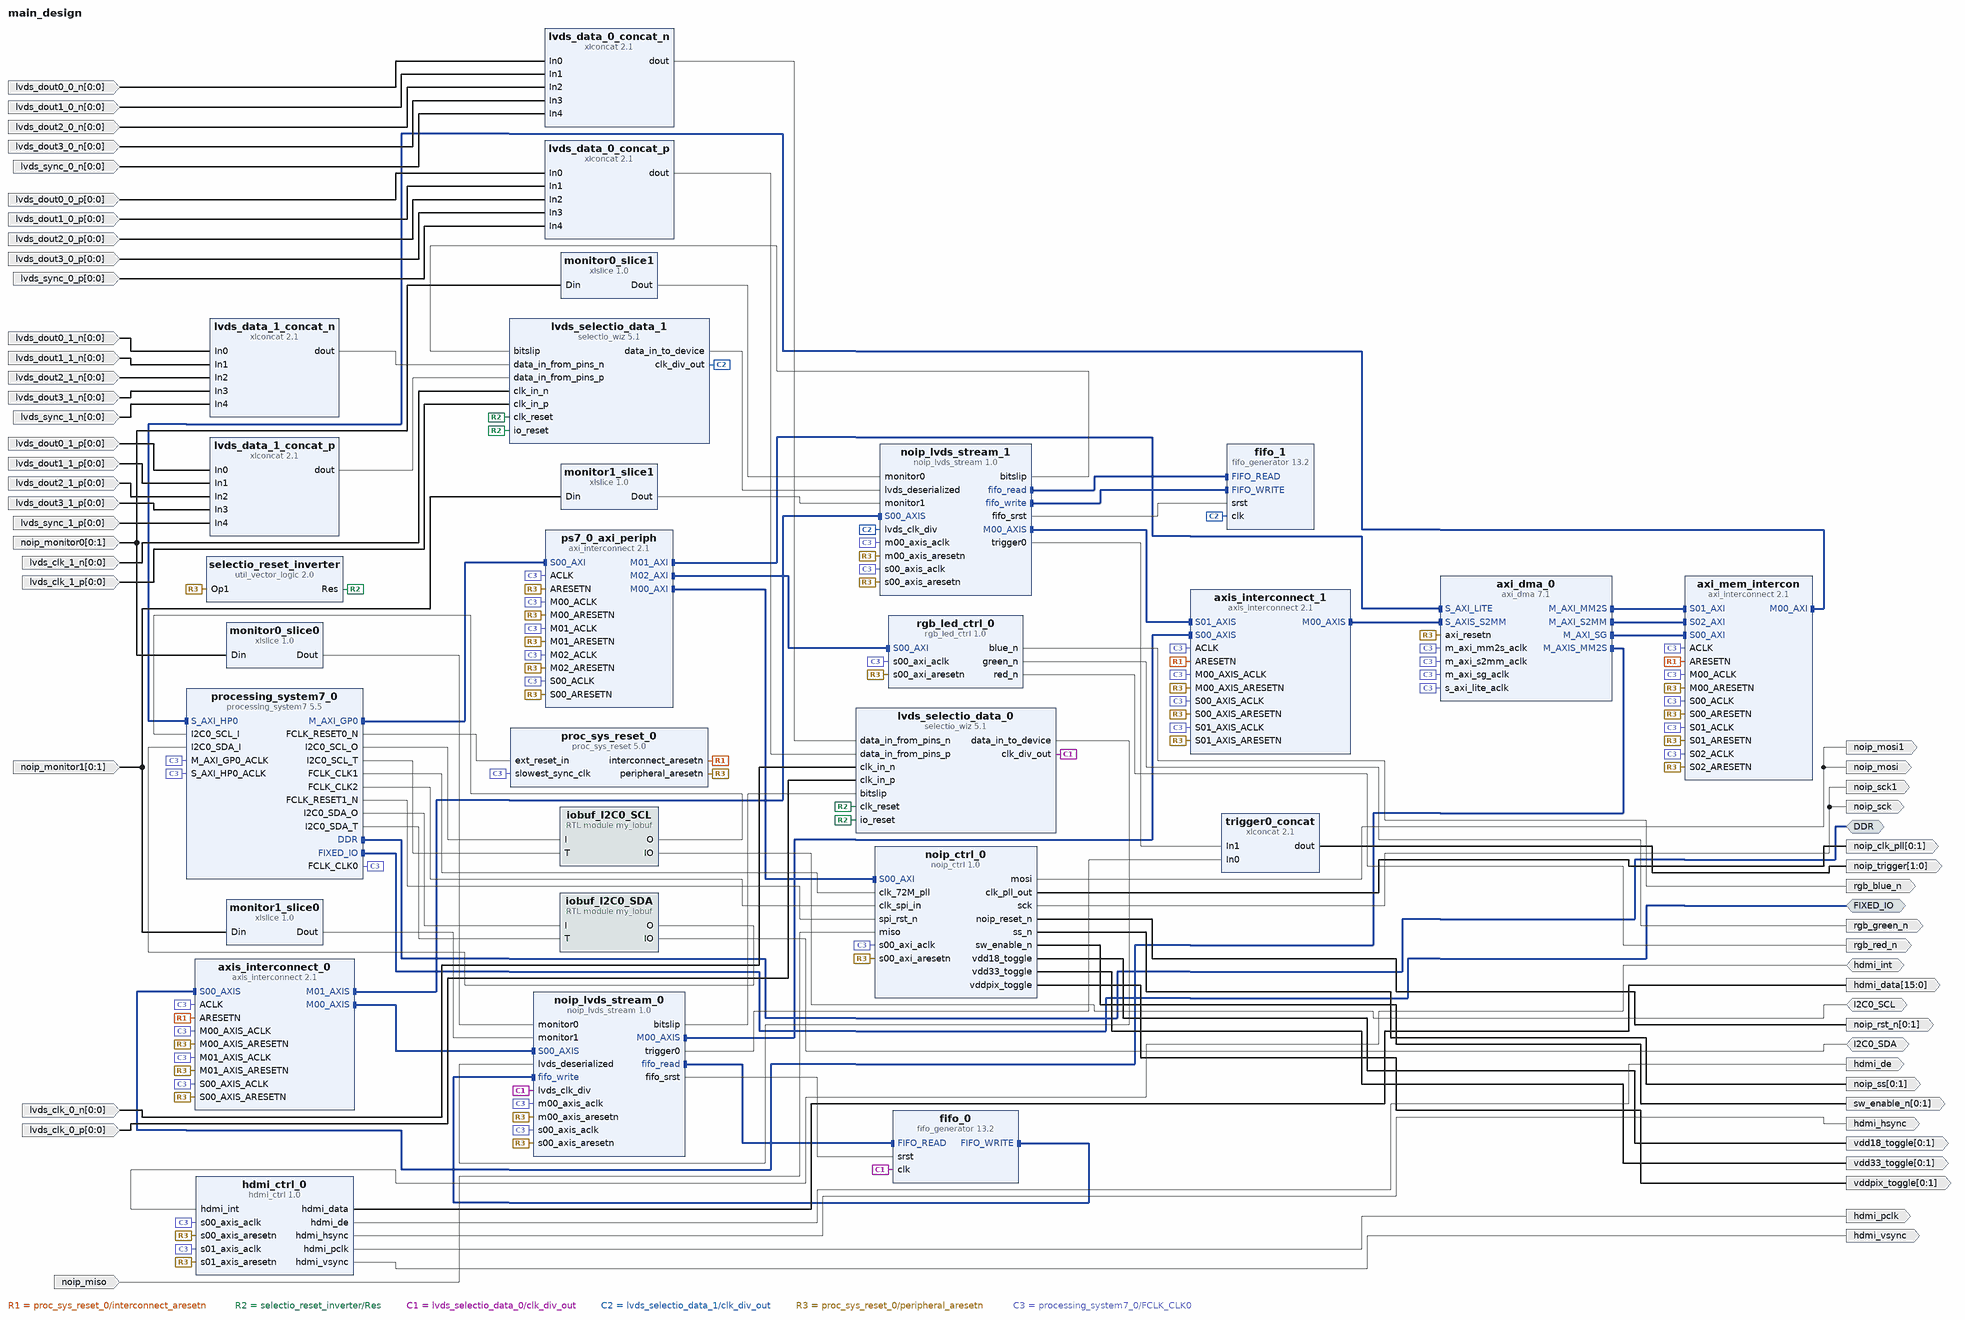
[diagram p0: block diagram of the top level]
# Vivado block design main_design, xc7z020clg400-2, Vivado 2024.1
create_bd_design main_design

create_bd_intf_port -mode Master -vlnv xilinx.com:interface:ddrx_rtl:1.0 DDR
create_bd_intf_port -mode Master -vlnv xilinx.com:display_processing_system7:fixedio_rtl:1.0 FIXED_IO
create_bd_port -dir O noip_mosi
create_bd_port -dir I noip_miso
create_bd_port -dir O noip_sck
create_bd_port -dir I -from 0 -to 0 -type clk lvds_clk_0_p
set_property -dict {CONFIG.FREQ_HZ 360000000} [get_bd_ports lvds_clk_0_p]
create_bd_port -dir I -from 0 -to 0 -type clk lvds_clk_0_n
set_property -dict {CONFIG.FREQ_HZ 360000000} [get_bd_ports lvds_clk_0_n]
create_bd_port -dir O -from 0 -to 1 noip_ss
create_bd_port -dir O -from 0 -to 1 noip_clk_pll
create_bd_port -dir O -from 1 -to 0 noip_trigger
create_bd_port -dir I -from 0 -to 1 -type data noip_monitor0
create_bd_port -dir I -from 0 -to 1 -type data noip_monitor1
create_bd_port -dir O -from 0 -to 1 noip_rst_n
create_bd_port -dir O -from 0 -to 1 vdd18_toggle
create_bd_port -dir O -from 0 -to 1 vdd33_toggle
create_bd_port -dir O -from 0 -to 1 vddpix_toggle
create_bd_port -dir O -from 0 -to 1 sw_enable_n
create_bd_port -dir I -from 0 -to 0 -type clk lvds_sync_0_p
create_bd_port -dir I -from 0 -to 0 -type clk lvds_sync_0_n
create_bd_port -dir I -from 0 -to 0 -type clk lvds_dout0_0_p
create_bd_port -dir I -from 0 -to 0 -type clk lvds_dout0_0_n
create_bd_port -dir I -from 0 -to 0 -type clk lvds_dout1_0_n
create_bd_port -dir I -from 0 -to 0 -type clk lvds_dout1_0_p
create_bd_port -dir I -from 0 -to 0 -type clk lvds_dout2_0_n
create_bd_port -dir I -from 0 -to 0 -type clk lvds_dout2_0_p
create_bd_port -dir I -from 0 -to 0 -type clk lvds_dout3_0_n
create_bd_port -dir I -from 0 -to 0 -type clk lvds_dout3_0_p
create_bd_port -dir I -from 0 -to 0 -type clk lvds_clk_1_n
set_property -dict {CONFIG.FREQ_HZ 360000000} [get_bd_ports lvds_clk_1_n]
create_bd_port -dir I -from 0 -to 0 -type clk lvds_clk_1_p
set_property -dict {CONFIG.FREQ_HZ 360000000} [get_bd_ports lvds_clk_1_p]
create_bd_port -dir I -from 0 -to 0 -type clk lvds_dout0_1_n
create_bd_port -dir I -from 0 -to 0 -type clk lvds_dout0_1_p
create_bd_port -dir I -from 0 -to 0 -type clk lvds_dout1_1_n
create_bd_port -dir I -from 0 -to 0 -type clk lvds_dout1_1_p
create_bd_port -dir I -from 0 -to 0 -type clk lvds_dout2_1_n
create_bd_port -dir I -from 0 -to 0 -type clk lvds_dout2_1_p
create_bd_port -dir I -from 0 -to 0 -type clk lvds_dout3_1_n
create_bd_port -dir I -from 0 -to 0 -type clk lvds_dout3_1_p
create_bd_port -dir I -from 0 -to 0 -type clk lvds_sync_1_p
create_bd_port -dir I -from 0 -to 0 -type clk lvds_sync_1_n
create_bd_port -dir O noip_mosi1
create_bd_port -dir O noip_sck1
create_bd_port -dir O -from 15 -to 0 hdmi_data
create_bd_port -dir O hdmi_vsync
create_bd_port -dir O hdmi_hsync
create_bd_port -dir O hdmi_de
create_bd_port -dir O -type clk hdmi_pclk
create_bd_port -dir IO hdmi_int
create_bd_port -dir IO I2C0_SDA
create_bd_port -dir IO I2C0_SCL
create_bd_port -dir O rgb_green_n
create_bd_port -dir O rgb_red_n
create_bd_port -dir O rgb_blue_n

create_bd_cell -type ip -vlnv xilinx.com:ip:processing_system7:5.5 processing_system7_0
set_property -dict [list \
  CONFIG.PCW_ENET0_ENET0_IO {MIO 16 .. 27} \
  CONFIG.PCW_ENET0_GRP_MDIO_ENABLE 0 \
  CONFIG.PCW_ENET0_PERIPHERAL_ENABLE 1 \
  CONFIG.PCW_EN_CLK1_PORT 1 \
  CONFIG.PCW_EN_CLK2_PORT 1 \
  CONFIG.PCW_EN_RST1_PORT 1 \
  CONFIG.PCW_FCLK_CLK1_BUF TRUE \
  CONFIG.PCW_FCLK_CLK2_BUF TRUE \
  CONFIG.PCW_FPGA0_PERIPHERAL_FREQMHZ 180 \
  CONFIG.PCW_FPGA1_PERIPHERAL_FREQMHZ 72 \
  CONFIG.PCW_FPGA2_PERIPHERAL_FREQMHZ 12 \
  CONFIG.PCW_FPGA_FCLK1_ENABLE 1 \
  CONFIG.PCW_FPGA_FCLK2_ENABLE 1 \
  CONFIG.PCW_GPIO_MIO_GPIO_ENABLE 0 \
  CONFIG.PCW_I2C0_I2C0_IO EMIO \
  CONFIG.PCW_I2C0_PERIPHERAL_ENABLE 1 \
  CONFIG.PCW_I2C_PERIPHERAL_FREQMHZ 111.111115 \
  CONFIG.PCW_UART1_PERIPHERAL_ENABLE 1 \
  CONFIG.PCW_UART1_UART1_IO {MIO 48 .. 49} \
  CONFIG.PCW_UART_PERIPHERAL_FREQMHZ 100 \
  CONFIG.PCW_UIPARAM_GENERATE_SUMMARY NONE \
  CONFIG.PCW_USE_S_AXI_HP0 1 \
] [get_bd_cells processing_system7_0]
# 96 more settings of processing_system7_0 are not shown: defaults, MIO pin electricals, DDR timing, and values the tool derives
create_bd_cell -type ip -vlnv xilinx.com:ip:proc_sys_reset:5.0 proc_sys_reset_0
create_bd_cell -type ip -vlnv xilinx.com:ip:axi_interconnect:2.1 ps7_0_axi_periph
set_property -dict {CONFIG.NUM_MI 3} [get_bd_cells ps7_0_axi_periph]
create_bd_cell -type ip -vlnv xilinx.com:ip:axi_interconnect:2.1 axi_mem_intercon
set_property -dict [list \
  CONFIG.NUM_MI 1 \
  CONFIG.NUM_SI 3 \
  CONFIG.S00_HAS_DATA_FIFO 2 \
  CONFIG.S01_HAS_DATA_FIFO 2 \
  CONFIG.S02_HAS_DATA_FIFO 2 \
  CONFIG.STRATEGY 2 \
] [get_bd_cells axi_mem_intercon]
create_bd_cell -type ip -vlnv user.org:user:noip_lvds_stream:1.0 noip_lvds_stream_0
set_property -dict {CONFIG.IM_HEIGHT 1024 CONFIG.IM_WIDTH 1280 CONFIG.SENSOR_BIT_LENGTH 8} [get_bd_cells noip_lvds_stream_0]
create_bd_cell -type ip -vlnv user.org:user:noip_ctrl:1.0 noip_ctrl_0
create_bd_cell -type ip -vlnv user.org:user:noip_lvds_stream:1.0 noip_lvds_stream_1
set_property -dict {CONFIG.IM_HEIGHT 1024 CONFIG.IM_WIDTH 1280 CONFIG.SENSOR_BIT_LENGTH 8} [get_bd_cells noip_lvds_stream_1]
create_bd_cell -type ip -vlnv xilinx.com:ip:axi_dma:7.1 axi_dma_0
set_property -dict {CONFIG.c_sg_include_stscntrl_strm 0} [get_bd_cells axi_dma_0]
create_bd_cell -type ip -vlnv xilinx.com:ip:axis_interconnect:2.1 axis_interconnect_0
set_property -dict {CONFIG.ARB_ON_TLAST 0 CONFIG.NUM_MI 2} [get_bd_cells axis_interconnect_0]
create_bd_cell -type ip -vlnv xilinx.com:ip:axis_interconnect:2.1 axis_interconnect_1
set_property -dict {CONFIG.NUM_MI 1 CONFIG.NUM_SI 2} [get_bd_cells axis_interconnect_1]
create_bd_cell -type ip -vlnv xilinx.com:ip:xlconcat:2.1 trigger0_concat
set_property -dict {CONFIG.NUM_PORTS 2} [get_bd_cells trigger0_concat]
create_bd_cell -type ip -vlnv xilinx.com:ip:xlslice:1.0 monitor0_slice0
set_property -dict {CONFIG.DIN_FROM 0 CONFIG.DIN_TO 0 CONFIG.DIN_WIDTH 2 CONFIG.DOUT_WIDTH 1} [get_bd_cells monitor0_slice0]
create_bd_cell -type ip -vlnv xilinx.com:ip:xlslice:1.0 monitor0_slice1
set_property -dict {CONFIG.DIN_FROM 1 CONFIG.DIN_TO 1 CONFIG.DIN_WIDTH 2 CONFIG.DOUT_WIDTH 1} [get_bd_cells monitor0_slice1]
create_bd_cell -type ip -vlnv xilinx.com:ip:xlslice:1.0 monitor1_slice0
set_property -dict {CONFIG.DIN_FROM 0 CONFIG.DIN_TO 0 CONFIG.DIN_WIDTH 2 CONFIG.DOUT_WIDTH 1} [get_bd_cells monitor1_slice0]
create_bd_cell -type ip -vlnv xilinx.com:ip:xlslice:1.0 monitor1_slice1
set_property -dict {CONFIG.DIN_FROM 1 CONFIG.DIN_TO 1 CONFIG.DIN_WIDTH 2 CONFIG.DOUT_WIDTH 1} [get_bd_cells monitor1_slice1]
create_bd_cell -type ip -vlnv user.org:user:hdmi_ctrl:1.0 hdmi_ctrl_0
create_bd_cell -type module -reference my_iobuf iobuf_I2C0_SDA
create_bd_cell -type module -reference my_iobuf iobuf_I2C0_SCL
create_bd_cell -type ip -vlnv xilinx.com:ip:xlconcat:2.1 lvds_data_0_concat_n
set_property -dict {CONFIG.NUM_PORTS 5} [get_bd_cells lvds_data_0_concat_n]
create_bd_cell -type ip -vlnv xilinx.com:ip:xlconcat:2.1 lvds_data_0_concat_p
set_property -dict {CONFIG.NUM_PORTS 5} [get_bd_cells lvds_data_0_concat_p]
create_bd_cell -type ip -vlnv xilinx.com:ip:util_vector_logic:2.0 selectio_reset_inverter
set_property -dict {CONFIG.C_OPERATION not CONFIG.C_SIZE 1} [get_bd_cells selectio_reset_inverter]
create_bd_cell -type ip -vlnv xilinx.com:ip:selectio_wiz:5.1 lvds_selectio_data_0
set_property -dict [list \
  CONFIG.BUS_DIR INPUTS \
  CONFIG.BUS_IO_STD LVDS_25 \
  CONFIG.BUS_SIG_TYPE DIFF \
  CONFIG.CLK_FWD false \
  CONFIG.CLK_FWD_IO_STD LVDS_25 \
  CONFIG.CLK_FWD_SIG_TYPE DIFF \
  CONFIG.SELIO_ACTIVE_EDGE SDR \
  CONFIG.SELIO_BUS_IN_DELAY NONE \
  CONFIG.SELIO_CLK_BUF BUFIO \
  CONFIG.SELIO_CLK_IO_STD LVDS_25 \
  CONFIG.SELIO_CLK_SIG_TYPE DIFF \
  CONFIG.SELIO_INTERFACE_TYPE NETWORKING \
  CONFIG.SERIALIZATION_FACTOR 8 \
  CONFIG.SYSTEM_DATA_WIDTH 5 \
  CONFIG.USE_SERIALIZATION true \
  CONFIG.USE_TEMPLATE Custom \
] [get_bd_cells lvds_selectio_data_0]
create_bd_cell -type ip -vlnv xilinx.com:ip:xlconcat:2.1 lvds_data_1_concat_n
set_property -dict {CONFIG.NUM_PORTS 5} [get_bd_cells lvds_data_1_concat_n]
create_bd_cell -type ip -vlnv xilinx.com:ip:xlconcat:2.1 lvds_data_1_concat_p
set_property -dict {CONFIG.NUM_PORTS 5} [get_bd_cells lvds_data_1_concat_p]
create_bd_cell -type ip -vlnv xilinx.com:ip:selectio_wiz:5.1 lvds_selectio_data_1
set_property -dict [list \
  CONFIG.BUS_DIR INPUTS \
  CONFIG.BUS_IO_STD LVDS_25 \
  CONFIG.BUS_SIG_TYPE DIFF \
  CONFIG.CLK_FWD false \
  CONFIG.CLK_FWD_IO_STD LVDS_25 \
  CONFIG.CLK_FWD_SIG_TYPE DIFF \
  CONFIG.SELIO_ACTIVE_EDGE SDR \
  CONFIG.SELIO_BUS_IN_DELAY NONE \
  CONFIG.SELIO_CLK_BUF BUFIO \
  CONFIG.SELIO_CLK_IO_STD LVDS_25 \
  CONFIG.SELIO_CLK_SIG_TYPE DIFF \
  CONFIG.SELIO_INTERFACE_TYPE NETWORKING \
  CONFIG.SERIALIZATION_FACTOR 8 \
  CONFIG.SYSTEM_DATA_WIDTH 5 \
  CONFIG.USE_SERIALIZATION true \
  CONFIG.USE_TEMPLATE Custom \
] [get_bd_cells lvds_selectio_data_1]
create_bd_cell -type ip -vlnv xilinx.com:ip:fifo_generator:13.2 fifo_0
set_property -dict {CONFIG.Input_Data_Width 64 CONFIG.Output_Data_Width 32} [get_bd_cells fifo_0]
create_bd_cell -type ip -vlnv xilinx.com:ip:fifo_generator:13.2 fifo_1
set_property -dict {CONFIG.Input_Data_Width 64 CONFIG.Output_Data_Width 32} [get_bd_cells fifo_1]
create_bd_cell -type ip -vlnv user.org:user:rgb_led_ctrl:1.0 rgb_led_ctrl_0

# ---- connections ----

connect_bd_intf_net [get_bd_intf_pins axis_interconnect_1/S00_AXIS] [get_bd_intf_pins noip_lvds_stream_0/M00_AXIS]
connect_bd_intf_net [get_bd_intf_pins axi_dma_0/M_AXIS_MM2S] [get_bd_intf_pins axis_interconnect_0/S00_AXIS]
connect_bd_intf_net [get_bd_intf_pins axi_dma_0/M_AXI_MM2S] [get_bd_intf_pins axi_mem_intercon/S01_AXI]
connect_bd_intf_net [get_bd_intf_pins axi_dma_0/M_AXI_S2MM] [get_bd_intf_pins axi_mem_intercon/S02_AXI]
connect_bd_intf_net [get_bd_intf_pins axi_dma_0/M_AXI_SG] [get_bd_intf_pins axi_mem_intercon/S00_AXI]
connect_bd_intf_net [get_bd_intf_pins axi_mem_intercon/M00_AXI] [get_bd_intf_pins processing_system7_0/S_AXI_HP0]
connect_bd_intf_net [get_bd_intf_pins axis_interconnect_0/M00_AXIS] [get_bd_intf_pins noip_lvds_stream_0/S00_AXIS]
connect_bd_intf_net [get_bd_intf_pins axis_interconnect_0/M01_AXIS] [get_bd_intf_pins noip_lvds_stream_1/S00_AXIS]
connect_bd_intf_net [get_bd_intf_pins axis_interconnect_1/M00_AXIS] [get_bd_intf_pins axi_dma_0/S_AXIS_S2MM]
connect_bd_intf_net [get_bd_intf_pins noip_lvds_stream_0/fifo_read] [get_bd_intf_pins fifo_0/FIFO_READ]
connect_bd_intf_net [get_bd_intf_pins fifo_0/FIFO_WRITE] [get_bd_intf_pins noip_lvds_stream_0/fifo_write]
connect_bd_intf_net [get_bd_intf_pins noip_lvds_stream_1/M00_AXIS] [get_bd_intf_pins axis_interconnect_1/S01_AXIS]
connect_bd_intf_net [get_bd_intf_pins noip_lvds_stream_1/fifo_read] [get_bd_intf_pins fifo_1/FIFO_READ]
connect_bd_intf_net [get_bd_intf_pins noip_lvds_stream_1/fifo_write] [get_bd_intf_pins fifo_1/FIFO_WRITE]
connect_bd_intf_net [get_bd_intf_ports DDR] [get_bd_intf_pins processing_system7_0/DDR]
connect_bd_intf_net [get_bd_intf_ports FIXED_IO] [get_bd_intf_pins processing_system7_0/FIXED_IO]
connect_bd_intf_net [get_bd_intf_pins processing_system7_0/M_AXI_GP0] [get_bd_intf_pins ps7_0_axi_periph/S00_AXI]
connect_bd_intf_net [get_bd_intf_pins ps7_0_axi_periph/M00_AXI] [get_bd_intf_pins noip_ctrl_0/S00_AXI]
connect_bd_intf_net [get_bd_intf_pins ps7_0_axi_periph/M01_AXI] [get_bd_intf_pins axi_dma_0/S_AXI_LITE]
connect_bd_intf_net [get_bd_intf_pins ps7_0_axi_periph/M02_AXI] [get_bd_intf_pins rgb_led_ctrl_0/S00_AXI]
connect_bd_net -net ARESETN_1 [get_bd_pins proc_sys_reset_0/interconnect_aresetn] \
  [get_bd_pins axi_mem_intercon/ARESETN] [get_bd_pins axis_interconnect_1/ARESETN] [get_bd_pins axis_interconnect_0/ARESETN]
connect_bd_net [get_bd_ports hdmi_int] [get_bd_pins hdmi_ctrl_0/hdmi_int]
connect_bd_net [get_bd_ports I2C0_SDA] [get_bd_pins iobuf_I2C0_SDA/IO]
connect_bd_net [get_bd_ports I2C0_SCL] [get_bd_pins iobuf_I2C0_SCL/IO]
connect_bd_net [get_bd_pins selectio_reset_inverter/Res] \
  [get_bd_pins lvds_selectio_data_0/clk_reset] [get_bd_pins lvds_selectio_data_0/io_reset] \
  [get_bd_pins lvds_selectio_data_1/io_reset] [get_bd_pins lvds_selectio_data_1/clk_reset]
connect_bd_net [get_bd_pins hdmi_ctrl_0/hdmi_data] [get_bd_ports hdmi_data]
connect_bd_net [get_bd_pins hdmi_ctrl_0/hdmi_de] [get_bd_ports hdmi_de]
connect_bd_net [get_bd_pins hdmi_ctrl_0/hdmi_hsync] [get_bd_ports hdmi_hsync]
connect_bd_net -net hdmi_ctrl_0_hdmi_pcl [get_bd_pins hdmi_ctrl_0/hdmi_pclk] [get_bd_ports hdmi_pclk]
connect_bd_net [get_bd_pins hdmi_ctrl_0/hdmi_vsync] [get_bd_ports hdmi_vsync]
connect_bd_net [get_bd_pins iobuf_I2C0_SCL/O] [get_bd_pins processing_system7_0/I2C0_SCL_I]
connect_bd_net [get_bd_ports lvds_clk_0_n] [get_bd_pins lvds_selectio_data_0/clk_in_n]
connect_bd_net [get_bd_ports lvds_clk_0_p] [get_bd_pins lvds_selectio_data_0/clk_in_p]
connect_bd_net [get_bd_ports lvds_clk_1_n] [get_bd_pins lvds_selectio_data_1/clk_in_n]
connect_bd_net [get_bd_ports lvds_clk_1_p] [get_bd_pins lvds_selectio_data_1/clk_in_p]
connect_bd_net [get_bd_pins lvds_data_0_concat_n/dout] [get_bd_pins lvds_selectio_data_0/data_in_from_pins_n]
connect_bd_net [get_bd_pins lvds_data_0_concat_p/dout] [get_bd_pins lvds_selectio_data_0/data_in_from_pins_p]
connect_bd_net [get_bd_pins lvds_data_1_concat_n/dout] [get_bd_pins lvds_selectio_data_1/data_in_from_pins_n]
connect_bd_net [get_bd_pins lvds_data_1_concat_p/dout] [get_bd_pins lvds_selectio_data_1/data_in_from_pins_p]
connect_bd_net [get_bd_ports lvds_dout0_0_n] [get_bd_pins lvds_data_0_concat_n/In0]
connect_bd_net [get_bd_ports lvds_dout0_0_p] [get_bd_pins lvds_data_0_concat_p/In0]
connect_bd_net [get_bd_ports lvds_dout0_1_n] [get_bd_pins lvds_data_1_concat_n/In0]
connect_bd_net [get_bd_ports lvds_dout0_1_p] [get_bd_pins lvds_data_1_concat_p/In0]
connect_bd_net [get_bd_ports lvds_dout1_0_n] [get_bd_pins lvds_data_0_concat_n/In1]
connect_bd_net [get_bd_ports lvds_dout1_0_p] [get_bd_pins lvds_data_0_concat_p/In1]
connect_bd_net [get_bd_ports lvds_dout1_1_n] [get_bd_pins lvds_data_1_concat_n/In1]
connect_bd_net [get_bd_ports lvds_dout1_1_p] [get_bd_pins lvds_data_1_concat_p/In1]
connect_bd_net [get_bd_ports lvds_dout2_0_n] [get_bd_pins lvds_data_0_concat_n/In2]
connect_bd_net [get_bd_ports lvds_dout2_0_p] [get_bd_pins lvds_data_0_concat_p/In2]
connect_bd_net [get_bd_ports lvds_dout2_1_n] [get_bd_pins lvds_data_1_concat_n/In2]
connect_bd_net [get_bd_ports lvds_dout2_1_p] [get_bd_pins lvds_data_1_concat_p/In2]
connect_bd_net [get_bd_ports lvds_dout3_0_n] [get_bd_pins lvds_data_0_concat_n/In3]
connect_bd_net [get_bd_ports lvds_dout3_0_p] [get_bd_pins lvds_data_0_concat_p/In3]
connect_bd_net [get_bd_ports lvds_dout3_1_n] [get_bd_pins lvds_data_1_concat_n/In3]
connect_bd_net [get_bd_ports lvds_dout3_1_p] [get_bd_pins lvds_data_1_concat_p/In3]
connect_bd_net [get_bd_pins lvds_selectio_data_0/clk_div_out] [get_bd_pins noip_lvds_stream_0/lvds_clk_div] [get_bd_pins fifo_0/clk]
connect_bd_net [get_bd_pins lvds_selectio_data_0/data_in_to_device] [get_bd_pins noip_lvds_stream_0/lvds_deserialized]
connect_bd_net [get_bd_pins lvds_selectio_data_1/clk_div_out] [get_bd_pins noip_lvds_stream_1/lvds_clk_div] [get_bd_pins fifo_1/clk]
connect_bd_net [get_bd_pins lvds_selectio_data_1/data_in_to_device] [get_bd_pins noip_lvds_stream_1/lvds_deserialized]
connect_bd_net [get_bd_ports lvds_sync_0_n] [get_bd_pins lvds_data_0_concat_n/In4]
connect_bd_net [get_bd_ports lvds_sync_0_p] [get_bd_pins lvds_data_0_concat_p/In4]
connect_bd_net [get_bd_ports lvds_sync_1_n] [get_bd_pins lvds_data_1_concat_n/In4]
connect_bd_net [get_bd_ports lvds_sync_1_p] [get_bd_pins lvds_data_1_concat_p/In4]
connect_bd_net [get_bd_pins monitor1_slice0/Dout] [get_bd_pins noip_lvds_stream_0/monitor1]
connect_bd_net [get_bd_pins monitor1_slice1/Dout] [get_bd_pins noip_lvds_stream_1/monitor1]
connect_bd_net -net my_iobuf_0_O [get_bd_pins iobuf_I2C0_SDA/O] [get_bd_pins processing_system7_0/I2C0_SDA_I]
connect_bd_net [get_bd_pins noip_ctrl_0/clk_pll_out] [get_bd_ports noip_clk_pll]
connect_bd_net [get_bd_pins noip_ctrl_0/mosi] [get_bd_ports noip_mosi] [get_bd_ports noip_mosi1]
connect_bd_net [get_bd_pins noip_ctrl_0/noip_reset_n] [get_bd_ports noip_rst_n]
connect_bd_net [get_bd_pins noip_ctrl_0/sck] [get_bd_ports noip_sck] [get_bd_ports noip_sck1]
connect_bd_net [get_bd_pins noip_ctrl_0/ss_n] [get_bd_ports noip_ss]
connect_bd_net [get_bd_pins noip_ctrl_0/sw_enable_n] [get_bd_ports sw_enable_n]
connect_bd_net [get_bd_pins noip_ctrl_0/vdd18_toggle] [get_bd_ports vdd18_toggle]
connect_bd_net [get_bd_pins noip_ctrl_0/vdd33_toggle] [get_bd_ports vdd33_toggle]
connect_bd_net [get_bd_pins noip_ctrl_0/vddpix_toggle] [get_bd_ports vddpix_toggle]
connect_bd_net [get_bd_pins noip_lvds_stream_0/bitslip] [get_bd_pins lvds_selectio_data_0/bitslip]
connect_bd_net [get_bd_pins noip_lvds_stream_0/fifo_srst] [get_bd_pins fifo_0/srst]
connect_bd_net [get_bd_pins noip_lvds_stream_0/trigger0] [get_bd_pins trigger0_concat/In0]
connect_bd_net [get_bd_pins noip_lvds_stream_1/bitslip] [get_bd_pins lvds_selectio_data_1/bitslip]
connect_bd_net [get_bd_pins noip_lvds_stream_1/fifo_srst] [get_bd_pins fifo_1/srst]
connect_bd_net [get_bd_pins noip_lvds_stream_1/trigger0] [get_bd_pins trigger0_concat/In1]
connect_bd_net [get_bd_ports noip_miso] [get_bd_pins noip_ctrl_0/miso]
connect_bd_net -net noip_monitor0_1 [get_bd_ports noip_monitor0] [get_bd_pins monitor0_slice0/Din] [get_bd_pins monitor0_slice1/Din]
connect_bd_net -net noip_monitor1_1 [get_bd_ports noip_monitor1] [get_bd_pins monitor1_slice0/Din] [get_bd_pins monitor1_slice1/Din]
connect_bd_net [get_bd_pins proc_sys_reset_0/peripheral_aresetn] \
  [get_bd_pins ps7_0_axi_periph/S00_ARESETN] [get_bd_pins ps7_0_axi_periph/M00_ARESETN] \
  [get_bd_pins ps7_0_axi_periph/ARESETN] [get_bd_pins ps7_0_axi_periph/M01_ARESETN] \
  [get_bd_pins axi_mem_intercon/M00_ARESETN] [get_bd_pins axi_mem_intercon/S00_ARESETN] \
  [get_bd_pins axi_mem_intercon/S01_ARESETN] [get_bd_pins axi_mem_intercon/S02_ARESETN] [get_bd_pins axi_dma_0/axi_resetn] \
  [get_bd_pins axis_interconnect_0/M00_AXIS_ARESETN] [get_bd_pins axis_interconnect_0/M01_AXIS_ARESETN] \
  [get_bd_pins axis_interconnect_0/S00_AXIS_ARESETN] [get_bd_pins axis_interconnect_1/M00_AXIS_ARESETN] \
  [get_bd_pins axis_interconnect_1/S00_AXIS_ARESETN] [get_bd_pins axis_interconnect_1/S01_AXIS_ARESETN] \
  [get_bd_pins hdmi_ctrl_0/s00_axis_aresetn] [get_bd_pins hdmi_ctrl_0/s01_axis_aresetn] \
  [get_bd_pins selectio_reset_inverter/Op1] [get_bd_pins noip_lvds_stream_0/s00_axis_aresetn] \
  [get_bd_pins noip_lvds_stream_0/m00_axis_aresetn] [get_bd_pins noip_lvds_stream_1/s00_axis_aresetn] \
  [get_bd_pins noip_lvds_stream_1/m00_axis_aresetn] [get_bd_pins noip_ctrl_0/s00_axi_aresetn] \
  [get_bd_pins rgb_led_ctrl_0/s00_axi_aresetn] [get_bd_pins ps7_0_axi_periph/M02_ARESETN]
connect_bd_net [get_bd_pins processing_system7_0/FCLK_CLK0] \
  [get_bd_pins proc_sys_reset_0/slowest_sync_clk] [get_bd_pins processing_system7_0/M_AXI_GP0_ACLK] \
  [get_bd_pins ps7_0_axi_periph/S00_ACLK] [get_bd_pins ps7_0_axi_periph/M00_ACLK] [get_bd_pins ps7_0_axi_periph/ACLK] \
  [get_bd_pins processing_system7_0/S_AXI_HP0_ACLK] [get_bd_pins ps7_0_axi_periph/M01_ACLK] \
  [get_bd_pins axi_mem_intercon/M00_ACLK] [get_bd_pins axi_mem_intercon/S00_ACLK] [get_bd_pins axi_mem_intercon/ACLK] \
  [get_bd_pins axi_mem_intercon/S01_ACLK] [get_bd_pins axi_mem_intercon/S02_ACLK] [get_bd_pins axi_dma_0/s_axi_lite_aclk] \
  [get_bd_pins axi_dma_0/m_axi_s2mm_aclk] [get_bd_pins axi_dma_0/m_axi_mm2s_aclk] [get_bd_pins axi_dma_0/m_axi_sg_aclk] \
  [get_bd_pins axis_interconnect_0/M00_AXIS_ACLK] [get_bd_pins axis_interconnect_0/M01_AXIS_ACLK] \
  [get_bd_pins axis_interconnect_0/S00_AXIS_ACLK] [get_bd_pins axis_interconnect_1/ACLK] \
  [get_bd_pins axis_interconnect_1/M00_AXIS_ACLK] [get_bd_pins axis_interconnect_1/S00_AXIS_ACLK] \
  [get_bd_pins axis_interconnect_1/S01_AXIS_ACLK] [get_bd_pins hdmi_ctrl_0/s00_axis_aclk] \
  [get_bd_pins hdmi_ctrl_0/s01_axis_aclk] [get_bd_pins noip_lvds_stream_0/s00_axis_aclk] \
  [get_bd_pins noip_lvds_stream_0/m00_axis_aclk] [get_bd_pins noip_lvds_stream_1/s00_axis_aclk] \
  [get_bd_pins noip_lvds_stream_1/m00_axis_aclk] [get_bd_pins noip_ctrl_0/s00_axi_aclk] \
  [get_bd_pins axis_interconnect_0/ACLK] [get_bd_pins rgb_led_ctrl_0/s00_axi_aclk] [get_bd_pins ps7_0_axi_periph/M02_ACLK]
connect_bd_net [get_bd_pins processing_system7_0/FCLK_CLK1] [get_bd_pins noip_ctrl_0/clk_72M_pll]
connect_bd_net [get_bd_pins processing_system7_0/FCLK_CLK2] [get_bd_pins noip_ctrl_0/clk_spi_in]
connect_bd_net [get_bd_pins processing_system7_0/FCLK_RESET0_N] [get_bd_pins proc_sys_reset_0/ext_reset_in]
connect_bd_net [get_bd_pins processing_system7_0/FCLK_RESET1_N] [get_bd_pins noip_ctrl_0/spi_rst_n]
connect_bd_net [get_bd_pins processing_system7_0/I2C0_SCL_O] [get_bd_pins iobuf_I2C0_SCL/I]
connect_bd_net [get_bd_pins processing_system7_0/I2C0_SCL_T] [get_bd_pins iobuf_I2C0_SCL/T]
connect_bd_net [get_bd_pins processing_system7_0/I2C0_SDA_O] [get_bd_pins iobuf_I2C0_SDA/I]
connect_bd_net [get_bd_pins processing_system7_0/I2C0_SDA_T] [get_bd_pins iobuf_I2C0_SDA/T]
connect_bd_net [get_bd_pins rgb_led_ctrl_0/blue_n] [get_bd_ports rgb_blue_n]
connect_bd_net [get_bd_pins rgb_led_ctrl_0/green_n] [get_bd_ports rgb_green_n]
connect_bd_net [get_bd_pins rgb_led_ctrl_0/red_n] [get_bd_ports rgb_red_n]
connect_bd_net [get_bd_pins trigger0_concat/dout] [get_bd_ports noip_trigger]
connect_bd_net -net xlslice_0_Dout [get_bd_pins monitor0_slice0/Dout] [get_bd_pins noip_lvds_stream_0/monitor0]
connect_bd_net -net xlslice_1_Dout [get_bd_pins monitor0_slice1/Dout] [get_bd_pins noip_lvds_stream_1/monitor0]

# ---- address map ----
assign_bd_address -offset 0x00000000 -range 512M -target_address_space [get_bd_addr_spaces axi_dma_0/Data_MM2S] [get_bd_addr_segs processing_system7_0/S_AXI_HP0/HP0_DDR_LOWOCM]
assign_bd_address -offset 0x00000000 -range 512M -target_address_space [get_bd_addr_spaces axi_dma_0/Data_S2MM] [get_bd_addr_segs processing_system7_0/S_AXI_HP0/HP0_DDR_LOWOCM]
assign_bd_address -offset 0x00000000 -range 512M -target_address_space [get_bd_addr_spaces axi_dma_0/Data_SG] [get_bd_addr_segs processing_system7_0/S_AXI_HP0/HP0_DDR_LOWOCM]
assign_bd_address -offset 0x40400000 -range 64K -target_address_space [get_bd_addr_spaces processing_system7_0/Data] [get_bd_addr_segs axi_dma_0/S_AXI_LITE/Reg]
assign_bd_address -offset 0x43C00000 -range 64K -target_address_space [get_bd_addr_spaces processing_system7_0/Data] [get_bd_addr_segs noip_ctrl_0/S00_AXI/S00_AXI_reg]
assign_bd_address -offset 0x43C10000 -range 64K -target_address_space [get_bd_addr_spaces processing_system7_0/Data] [get_bd_addr_segs rgb_led_ctrl_0/S00_AXI/S00_AXI_reg]

validate_bd_design
save_bd_design
